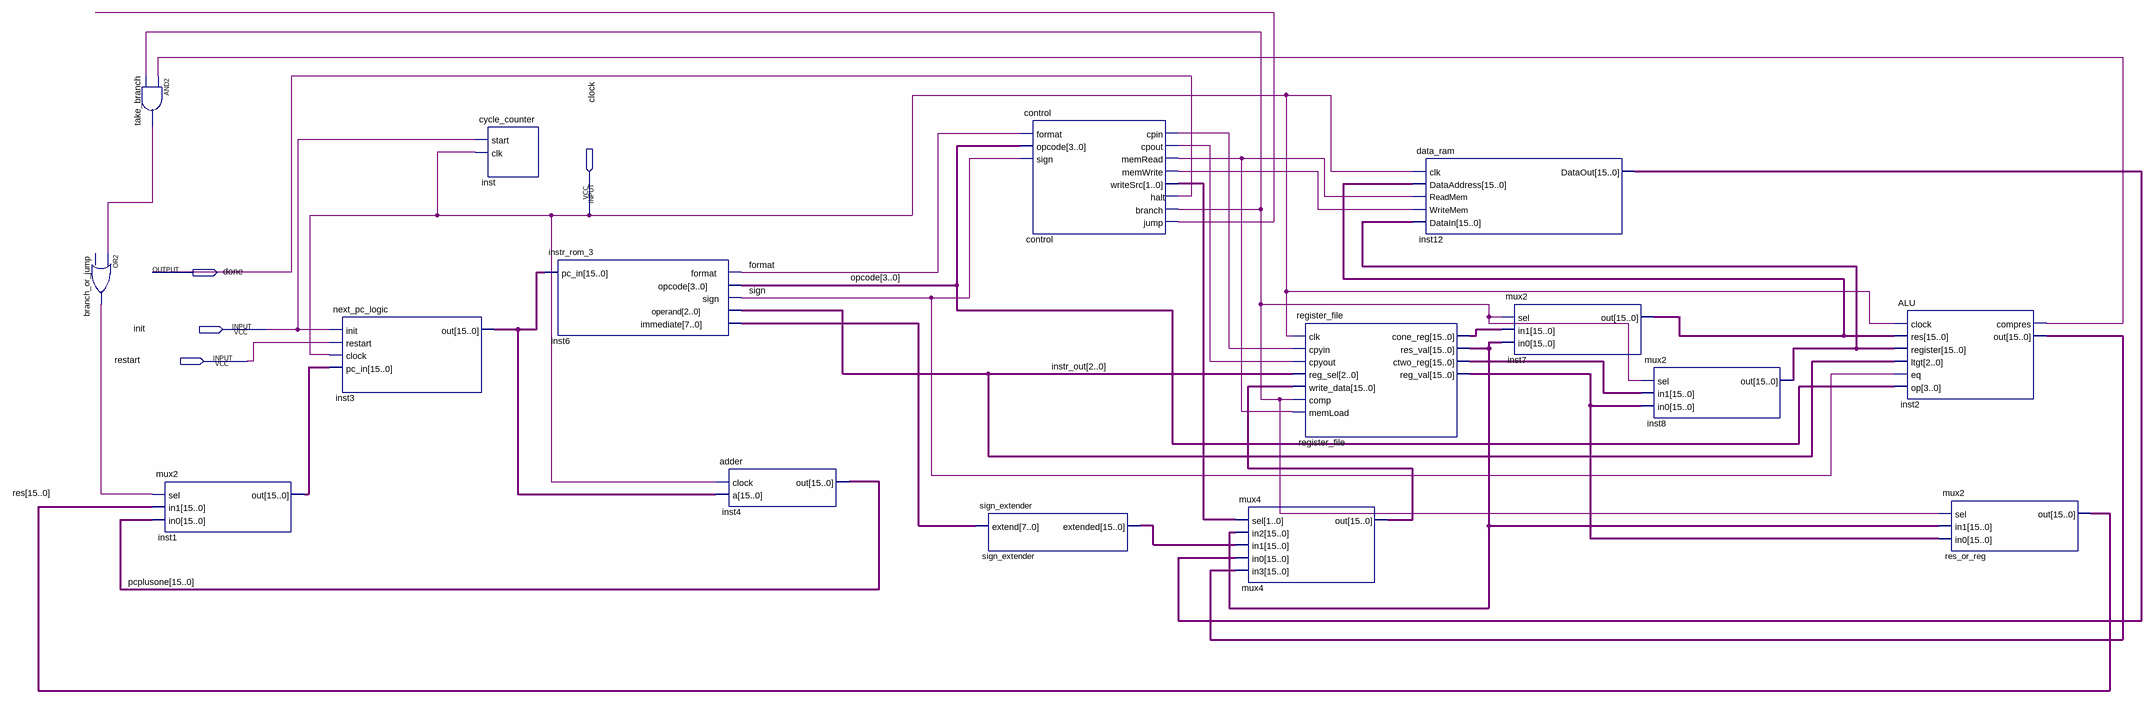
[diagram p0: schematic sheet]
// Quartus schematic processor.bdf as structural Verilog: 16 symbols, 4 pins
module processor (
  input  clock,
  input  init,
  input  restart,
  output done
);

  wire branch_or_jump_out, control_branch, control_cpin, control_cpout, control_jump, control_memread,
       control_memwrite, format, inst2_compres, sign, take_branch_out;
  wire [1:0] control_writesrc;
  wire [2:0] instr_out;
  wire [3:0] opcode;
  wire [7:0] inst6_immediate;
  wire [15:0] inst1_out, inst2_out, inst3_out, inst7_out, inst8_out, inst12_dataout, mux4_out, pcplusone,
       register_file_cone_reg, register_file_ctwo_reg, register_file_reg_val, register_file_res_val, res,
       sign_extender_extended;

  buf branch_or_jump (branch_or_jump_out, take_branch_out);  // OR2 open: IN2
  and take_branch (take_branch_out, inst2_compres, control_branch);
  mux2 inst1 (.sel(branch_or_jump_out), .in1(res), .in0(pcplusone), .out(inst1_out));
  next_pc_logic inst3 (.init(init), .restart(restart), .clock(clock), .pc_in(inst1_out), .out(inst3_out));
  cycle_counter inst (.start(init), .clk(clock));
  instr_rom_3 inst6 (
    .pc_in(inst3_out), .format(format), .opcode(opcode), .sign(sign), .operand(instr_out),
    .immediate(inst6_immediate));
  adder inst4 (.clock(clock), .a(inst3_out), .out(pcplusone));
  sign_extender sign_extender (.extend(inst6_immediate), .extended(sign_extender_extended));
  control control (
    .format(format), .opcode(opcode), .sign(sign), .cpin(control_cpin), .cpout(control_cpout),
    .memRead(control_memread), .memWrite(control_memwrite), .writeSrc(control_writesrc), .halt(done),
    .branch(control_branch), .jump(control_jump));
  mux4 mux4 (
    .sel(control_writesrc), .in2(register_file_res_val), .in1(sign_extender_extended), .in0(inst12_dataout),
    .in3(inst2_out), .out(mux4_out));
  register_file register_file (
    .clk(clock), .cpyin(control_cpin), .cpyout(control_cpout), .reg_sel(instr_out), .write_data(mux4_out),
    .comp(control_branch), .memLoad(control_memread), .cone_reg(register_file_cone_reg),
    .res_val(register_file_res_val), .ctwo_reg(register_file_ctwo_reg), .reg_val(register_file_reg_val));
  data_ram inst12 (
    .clk(clock), .DataAddress(inst7_out), .ReadMem(control_memread), .WriteMem(control_memwrite),
    .DataIn(inst8_out), .DataOut(inst12_dataout));
  mux2 inst7 (.sel(control_branch), .in1(register_file_cone_reg), .in0(register_file_res_val), .out(inst7_out));
  mux2 inst8 (.sel(control_branch), .in1(register_file_ctwo_reg), .in0(register_file_reg_val), .out(inst8_out));
  ALU inst2 (
    .clock(clock), .res(inst7_out), .register(inst8_out), .ltgt(instr_out), .eq(sign), .op(opcode),
    .compres(inst2_compres), .out(inst2_out));
  mux2 res_or_reg (.sel(control_branch), .in1(register_file_res_val), .in0(register_file_reg_val), .out(res));
endmodule
